# Altium schematic sheet RS485_RGB_Atmega328.SchDoc
size A4
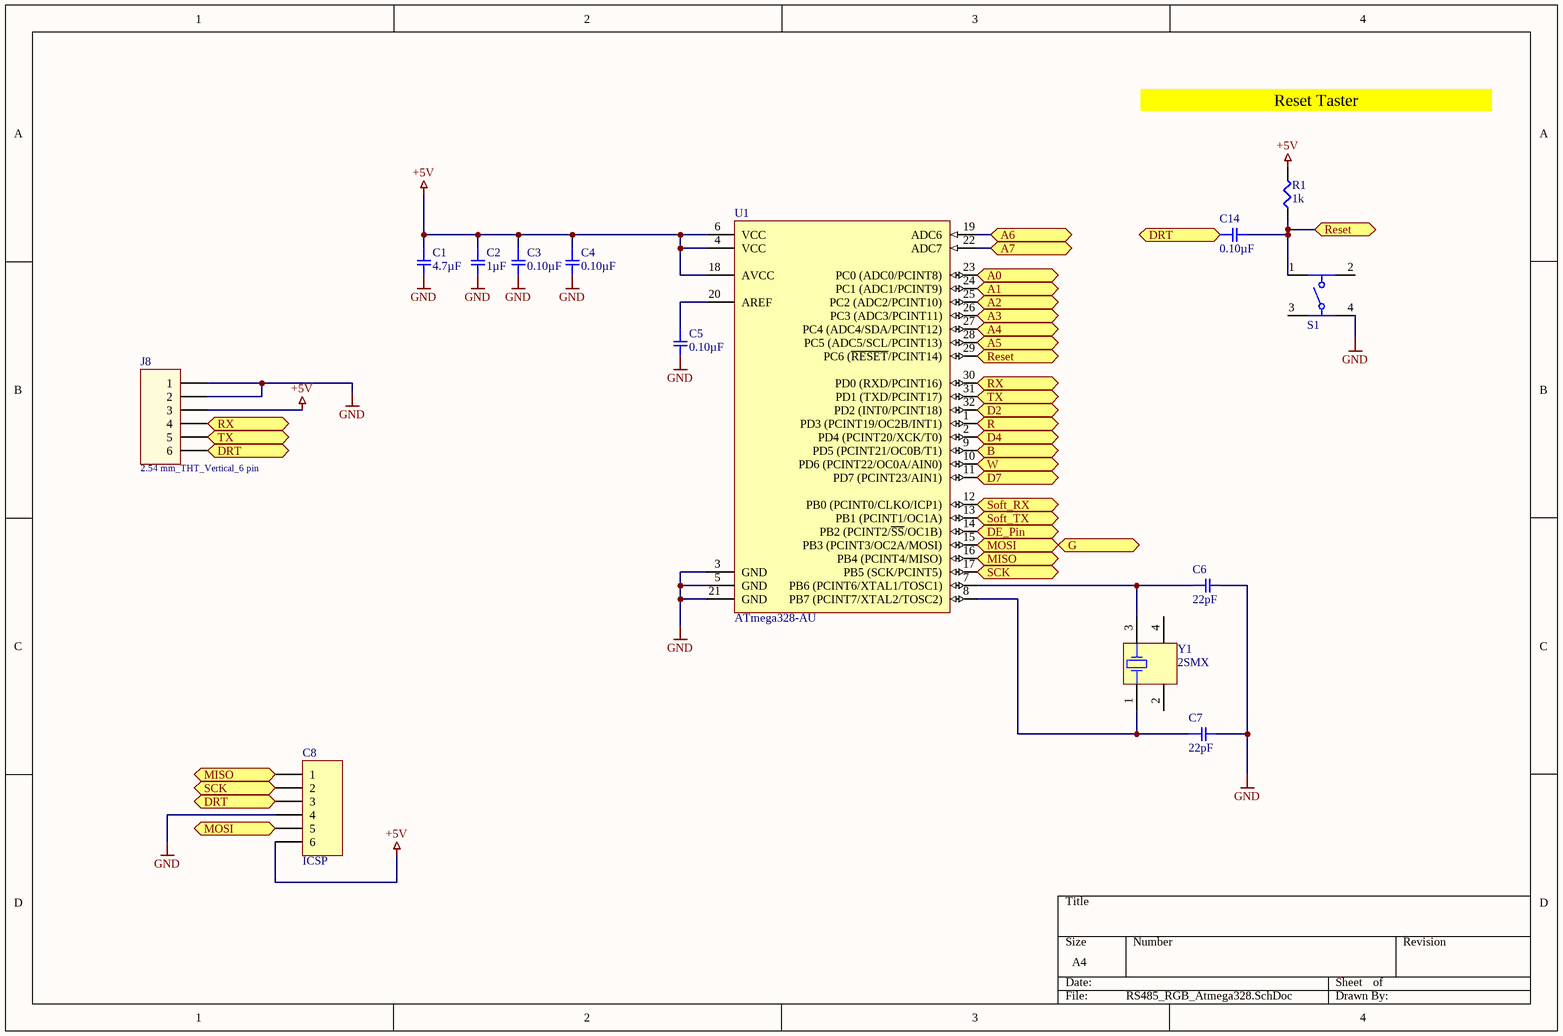
[diagram p0: RS485_RGB_Atmega328.SchDoc]

## Parts
C1  4.7µF  [SMD-0603C]
C2  1µF  [SMD-0603C]
C3  0.10µF  [SMD-0603C]
C4  0.10µF  [SMD-0603C]
C5  0.10µF  [SMD-0603C]
C6  22pF  [SMD-0603C]
C7  22pF  [SMD-0603C]
C8  ICSP  [TC2030-MCP-NL]
C14  0.10µF  [SMD-0603C]
J8  2.54 mm_THT_Vertical_6 pin  [61300611121]
R1  1k  [SMD-0603-RES]
S1  430453025836  [430453025836]  (value not drawn)
U1  ATmega328-AU  [32A_N]
Y1  2SMX  [2SMX]

## Ports
A0, A1, A2, A3, A4, A5, A6, A7, B, D2, D4, D7, DE_Pin, DRT, G, MISO, MOSI, R, Reset, RX, SCK, Soft_RX, Soft_TX, TX, W

## Nets
+5V: C1.1 C2.1 C3.1 C4.1 C8.6 J8.3 R1.2 U1.4(VCC) U1.6(VCC) U1.18(AVCC)
GND: C1.2 C2.2 C3.2 C4.2 C5.2 C6.2 C7.2 C8.4 J8.1 J8.2 S1.4 U1.3(GND) U1.5(GND) U1.21(GND)
A0: U1.23(PC0_(ADC0/PCINT8)) ; port A0
A1: U1.24(PC1_(ADC1/PCINT9)) ; port A1
A2: U1.25(PC2_(ADC2/PCINT10)) ; port A2
A3: U1.26(PC3_(ADC3/PCINT11)) ; port A3
A4: U1.27(PC4_(ADC4/SDA/PCINT12)) ; port A4
A5: U1.28(PC5_(ADC5/SCL/PCINT13)) ; port A5
A6: U1.19(ADC6) ; port A6
A7: U1.22(ADC7) ; port A7
B: U1.9(PD5_(PCINT21/OC0B/T1)) ; port B
D2: U1.32(PD2_(INT0/PCINT18)) ; port D2
D4: U1.2(PD4_(PCINT20/XCK/T0)) ; port D4
D7: U1.11(PD7_(PCINT23/AIN1)) ; port D7
DE_Pin: U1.14(PB2_(PCINT2/~{SS}/OC1B)) ; port DE_Pin
DRT: C8.3 C14.1 J8.6 ; port DRT
G: C8.5 U1.15(PB3_(PCINT3/OC2A/MOSI)) ; port MOSI, port G
MISO: C8.1 U1.16(PB4_(PCINT4/MISO)) ; port MISO
R: U1.1(PD3_(PCINT19/OC2B/INT1)) ; port R
Reset: C14.2 R1.1 S1.1 U1.29(PC6_(~{RESET}/PCINT14)) ; port Reset
RX: J8.4 U1.30(PD0_(RXD/PCINT16)) ; port RX
SCK: C8.2 U1.17(PB5_(SCK/PCINT5)) ; port SCK
Soft_RX: U1.12(PB0_(PCINT0/CLKO/ICP1)) ; port Soft_RX
Soft_TX: U1.13(PB1_(PCINT1/OC1A)) ; port Soft_TX
TX: J8.5 U1.31(PD1_(TXD/PCINT17)) ; port TX
W: U1.10(PD6_(PCINT22/OC0A/AIN0)) ; port W
NetC5_1: C5.1 U1.20(AREF)
NetC6_1: C6.1 U1.7(PB6_(PCINT6/XTAL1/TOSC1)) Y1.3(OSC2)
NetC7_1: C7.1 U1.8(PB7_(PCINT7/XTAL2/TOSC2)) Y1.1(OSC1)

Not connected (* = marked no-connect by the designer): S1 2 3; Y1 2(NC) 4(NC)

## Notes on the sheet
- Reset Taster

## Library data of the parts
C1 = GRM188C80G475KE19D: CAP CER 4.7UF 4V X6S 0603; Manufacturer: Murata Electronics North America; Factory Stock: 0; Unit Price (USD): 0.11; Minimum Quantity: 1; Tolerance: ±10%; Datasheets: http://www.murata.com/~/media/webrenewal/support/library/catalog/products/capacitor/mlcc/c02e.pdf; Image: //media.digikey.com/Renders/Murata%20Renders/ZRB-SERIES-0402.jpg; Digi-Key Part Number: 490-6402-1-ND; Part Number: GRM188C80G475KE19D; Quantity Available: 22219; @ qty: 0; Packaging: Cut Tape (CT); Series: GRM; Part Status: Active; Value: 4.7µF; Voltage: 4V; Temperature Coefficient: X6S; Operating Temperature: -55°C ~ 105°C; Features: -; Ratings: -; Applications: General Purpose; Mounting Type: Surface Mount, MLCC; Package / Case: 0603 (1608 Metric); Size / Dimension: 0.063" L x 0.031" W (1.60mm x 0.80mm); Height - Seated (Max): -; Thickness (Max): 0.035" (0.90mm); Lead Spacing: -; Lead Style: -
C2 = GRM185C81A105KE36D: CAP CER 1UF 10V X6S 0603; Manufacturer: Murata Electronics North America; Factory Stock: 0; Unit Price (USD): 0.2; Minimum Quantity: 1; Tolerance: ±10%; Datasheets: http://www.murata.com/~/media/webrenewal/support/library/catalog/products/capacitor/mlcc/c02e.pdf; Image: //media.digikey.com/Renders/Murata%20Renders/ZRB-SERIES-0402.jpg; Digi-Key Part Number: 490-11987-1-ND; Part Number: GRM185C81A105KE36D; Quantity Available: 4005; @ qty: 0; Packaging: Cut Tape (CT); Series: GRM; Part Status: Active; Value: 1µF; Voltage: 10V; Temperature Coefficient: X6S; Operating Temperature: -55°C ~ 105°C; Features: -; Ratings: -; Applications: General Purpose; Mounting Type: Surface Mount, MLCC; Package / Case: 0603 (1608 Metric); Size / Dimension: 0.063" L x 0.031" W (1.60mm x 0.80mm); Height - Seated (Max): -; Thickness (Max): 0.020" (0.50mm); Lead Spacing: -; Lead Style: -
C3-C5 C14 = GCJ188R72A104KA01D: CAP CER 0.1UF 100V X7R 0603; Manufacturer: Murata Electronics North America; Factory Stock: 0; Unit Price (USD): 0.23; Minimum Quantity: 1; Tolerance: ±10%; Datasheets: http://www.murata.com/~/media/webrenewal/support/library/catalog/products/capacitor/mlcc/c03e.ashx; Image: //media.digikey.com/Renders/Murata%20Renders/0603%28LQG18%29.jpg; Digi-Key Part Number: 490-13420-1-ND; Part Number: GCJ188R72A104KA01D; Quantity Available: 2728; @ qty: 0; Packaging: Cut Tape (CT); Series: GCJ; Part Status: Active; Value: 0.10µF; Voltage: 100V; Temperature Coefficient: X7R; Operating Temperature: -55°C ~ 125°C; Features: Soft Termination; Ratings: AEC-Q200; Applications: Automotive, Boardflex Sensitive; Mounting Type: Surface Mount, MLCC; Package / Case: 0603 (1608 Metric); Size / Dimension: 0.063" L x 0.031" W (1.60mm x 0.80mm); Height - Seated (Max): -; Thickness (Max): 0.035" (0.90mm); Lead Spacing: -; Lead Style: -
C6 C7 = GCM1885C1H220JA16D: CAP CER 22PF 50V NP0 0603; Manufacturer: Murata Electronics North America; Factory Stock: 0; Unit Price (USD): 0.1; Minimum Quantity: 1; Tolerance: ±5%; Temperature Coefficient: C0G, NP0; Datasheets: http://www.murata.com/~/media/webrenewal/support/library/catalog/products/capacitor/mlcc/c03e.ashx; Image: //media.digikey.com/Renders/Murata%20Renders/0603%28GCM188%29.jpg; Digi-Key Part Number: 490-4958-1-ND; Part Number: GCM1885C1H220JA16D; Quantity Available: 95195; @ qty: 0; Packaging: Cut Tape (CT); Series: GCM; Part Status: Active; Value: 22pF; Voltage: 50V; Operating Temperature: -55°C ~ 125°C; Features: -; Ratings: AEC-Q200; Applications: Automotive; Mounting Type: Surface Mount, MLCC; Package / Case: 0603 (1608 Metric); Size / Dimension: 0.063" L x 0.031" W (1.60mm x 0.80mm); Height - Seated (Max): -; Thickness (Max): 0.035" (0.90mm); Lead Spacing: -; Lead Style: -
J8 = 61300611121: Pin Header WR-PHD, pitch 2.54 mm, THT, Vertical, single row, 6 pin; Rated Current: 3 A; Pin Number: 6; Pitch: 2.54 mm; Working Voltage: 250 VAC; Contact Resistance: 20 mOhm; Insulation Resistance: >1000 MOhm; ComponentLink1Description: Manufacturer; ComponentLink1URL: http://www.we-online.de; ComponentLink2Description: Datasheet; ComponentLink2URL: http://katalog.we-online.de/em/datasheet/6130xx11121.pdf; Part Number: 61300611121; Published Date: Jan. 2018; Publisher: Wurth Elektronik; Operating Temperature: -40 to 105 degC; Mounting Technology: THT; Row Number: Single; Orientation: Vertical
R1 = ERJ-3EKF1001V: RES SMD 1K OHM 1% 1/10W 0603; Manufacturer: Panasonic Electronic Components; Factory Stock: 0; Unit Price (USD): 0.00379; @ qty: 1500; Minimum Quantity: 1; Power (Watts): 0.1W, 1/10W; Temperature Coefficient: ±100ppm/°C; Part Number: ERJ-3EKF1001V; Datasheets: http://industrial.panasonic.com/www-cgi/jvcr13pz.cgi?E+PZ+3+AOA0002+ERJ3EKF1001V+7+WW; Image: //media.digikey.com/Photos/Panasonic%20Photos/MFG_ERJ-P6W%20Series.jpg; Digi-Key Part Number: P1.00KHCT-ND; Quantity Available: 5218845; Packaging: Cut Tape (CT); Series: ERJ; Part Status: Active; Value: 1k; Tolerance: ±1%; Composition: Thick Film; Features: Automotive AEC-Q200; Operating Temperature: -55°C ~ 155°C; Package / Case: 0603 (1608 Metric); Supplier Device Package: 0603; Size / Dimension: 0.063" L x 0.031" W (1.60mm x 0.80mm); Height - Seated (Max): 0.022" (0.55mm); Number of Terminations: 2; Failure Rate: -
S1 = 430453025836: 6x6mm SMD J-Bend washable WS-TASV, height 2.5 mm, 360 gf; Rated Current: 50 mA; Operation Force: 360 gf; Rated Voltage: 12 VDC; ComponentLink1Description: Manufacturer; ComponentLink1URL: http://www.we-online.de; ComponentLink2Description: Datasheet; ComponentLink2URL: http://katalog.we-online.de/em/datasheet/4304x3xxx8x6.pdf; Part Number: 430453025836; Published Date: Nov. 2017; Publisher: Wurth Elektronik; Life Cycle: 200000; Operating Temperature: -40 to +85 degC; Size: 6x6x2.5 mm
U1 = ATmega328-AU: 8-bit AVR Microcontroller, 32KB Flash, 1KB EEPROM, 2KB SRAM, 32-pin TQFP, Industrial Grade (-40°C to 85°C); Published: 1-Apr-2010; DatasheetVersion: revA, Jan-2010; PackageVersion: revB, Oct-2001; PackageReference: 32A; Publisher: Altium Limited; PackageDescription: 32-Lead, 7x7x1.0 mm Body, 0.8mm Lead Pitch, Thin Profile Plastic Quad Flat Package (TQFP); Supplier 1: Digi-Key; Supplier Part Number 1: ATMEGA328-AU-ND; Supplier 2: Mouser; Supplier Part Number 2: 556-ATMEGA328-AU; Code_JEDEC: MS-026-ABA; ComponentLink1Description: Manufacturer Link; ComponentLink1URL: http://www.atmel.com/products/avr/default.asp?; ComponentLink2Description: ATmega48A/48PA/88A/88PA/168A/168PA/328/328P Datasheet; ComponentLink2URL: http://www.atmel.com/dyn/resources/prod_documents/8271.pdf; ComponentLink3Description: ATmega48A/48PA/88A/88PA/168A/168PA/328/328P Summary; ComponentLink3URL: http://www.atmel.com/dyn/resources/prod_documents/8271S.pdf; ComponentLink4Description: Atmel.com Home; ComponentLink4URL: http://www.atmel.com
Y1 = 2SMX: Surface Mount Quartz Crystal; Note: PCB layout complies with manufacturer's recommendation.; Published: 17-Jul-2002; DatasheetDocument: 9-Sep-1999; PackageDocument: 9-Sep-1999; PackageReference: 2SMX; Publisher: Altium Limited; ComponentLink1Description: Manufacturer Link; ComponentLink1URL: http://www.cmac.com/mt/